# EAGLE schematic HackmodWear (EAGLE 9.1.0)
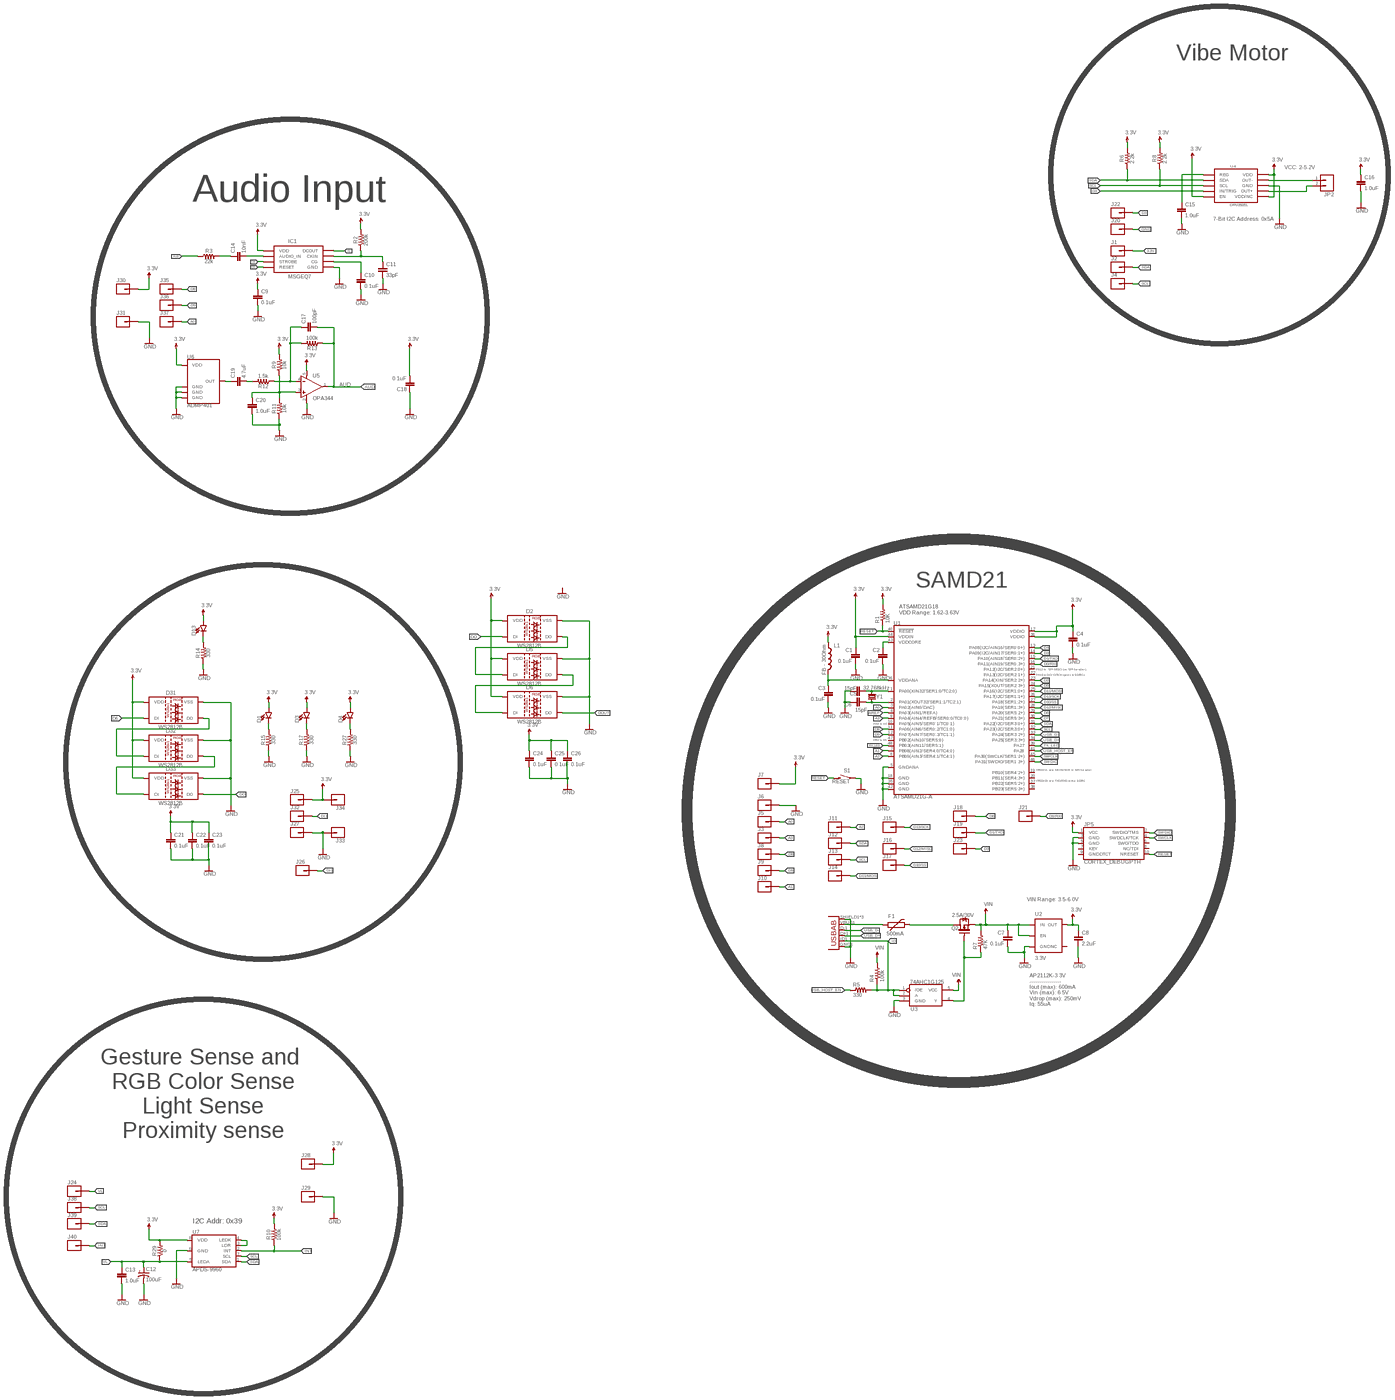
[diagram p0: schematic, sheet 1, overview]
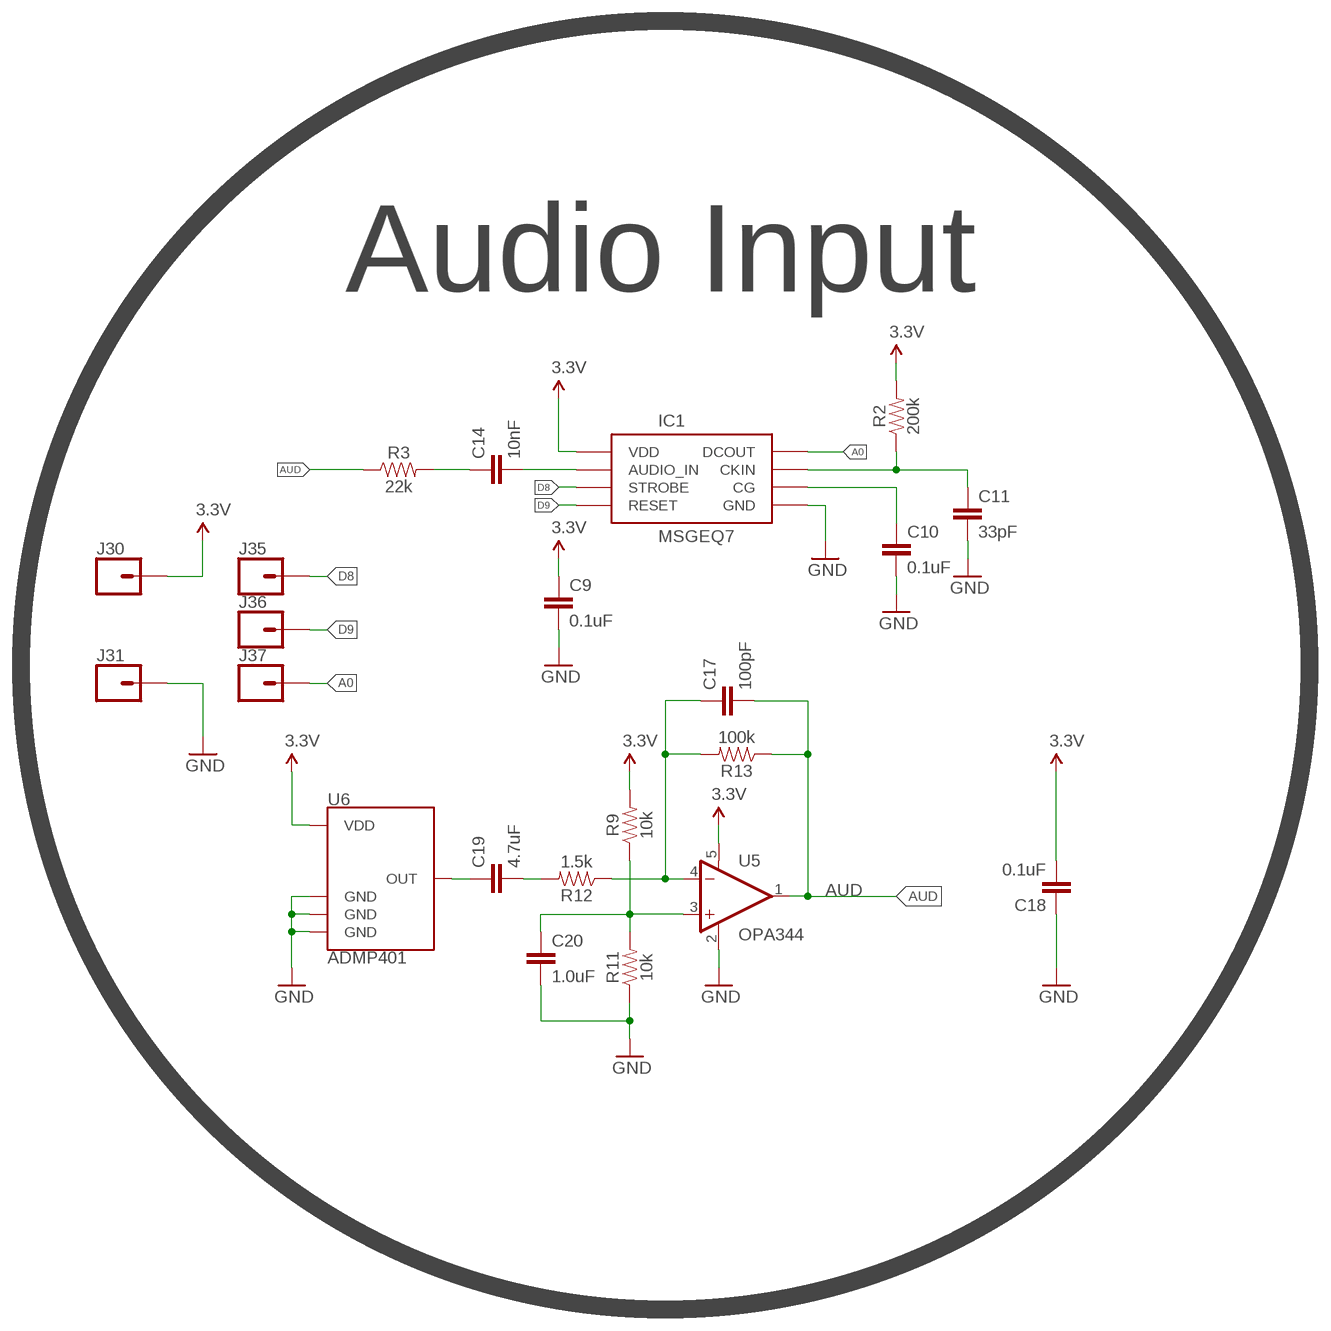
[diagram p1: schematic, sheet 1, part 1 of 4]
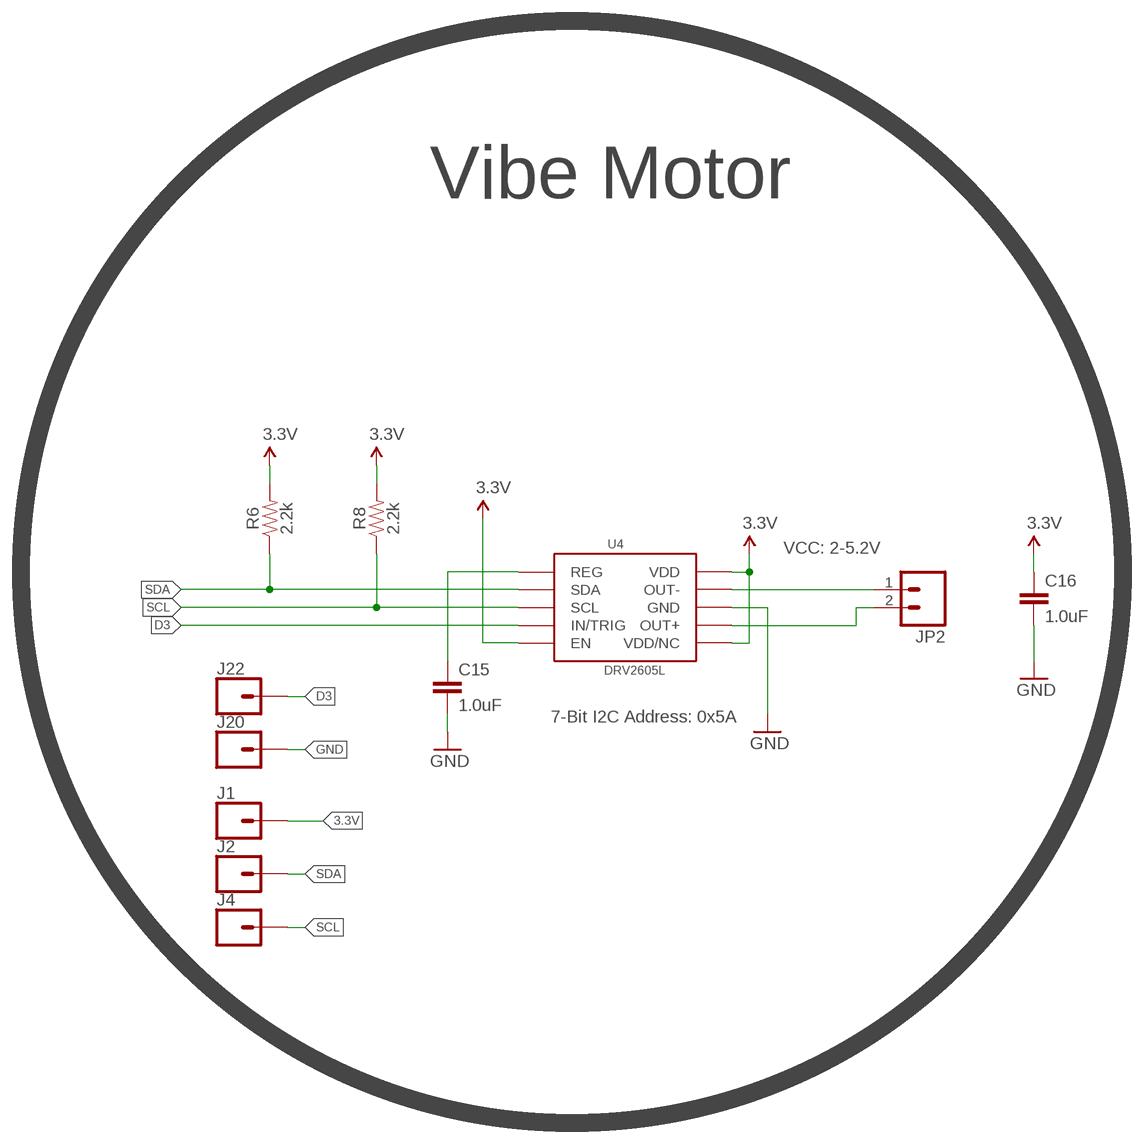
[diagram p2: schematic, sheet 1, part 2 of 4]
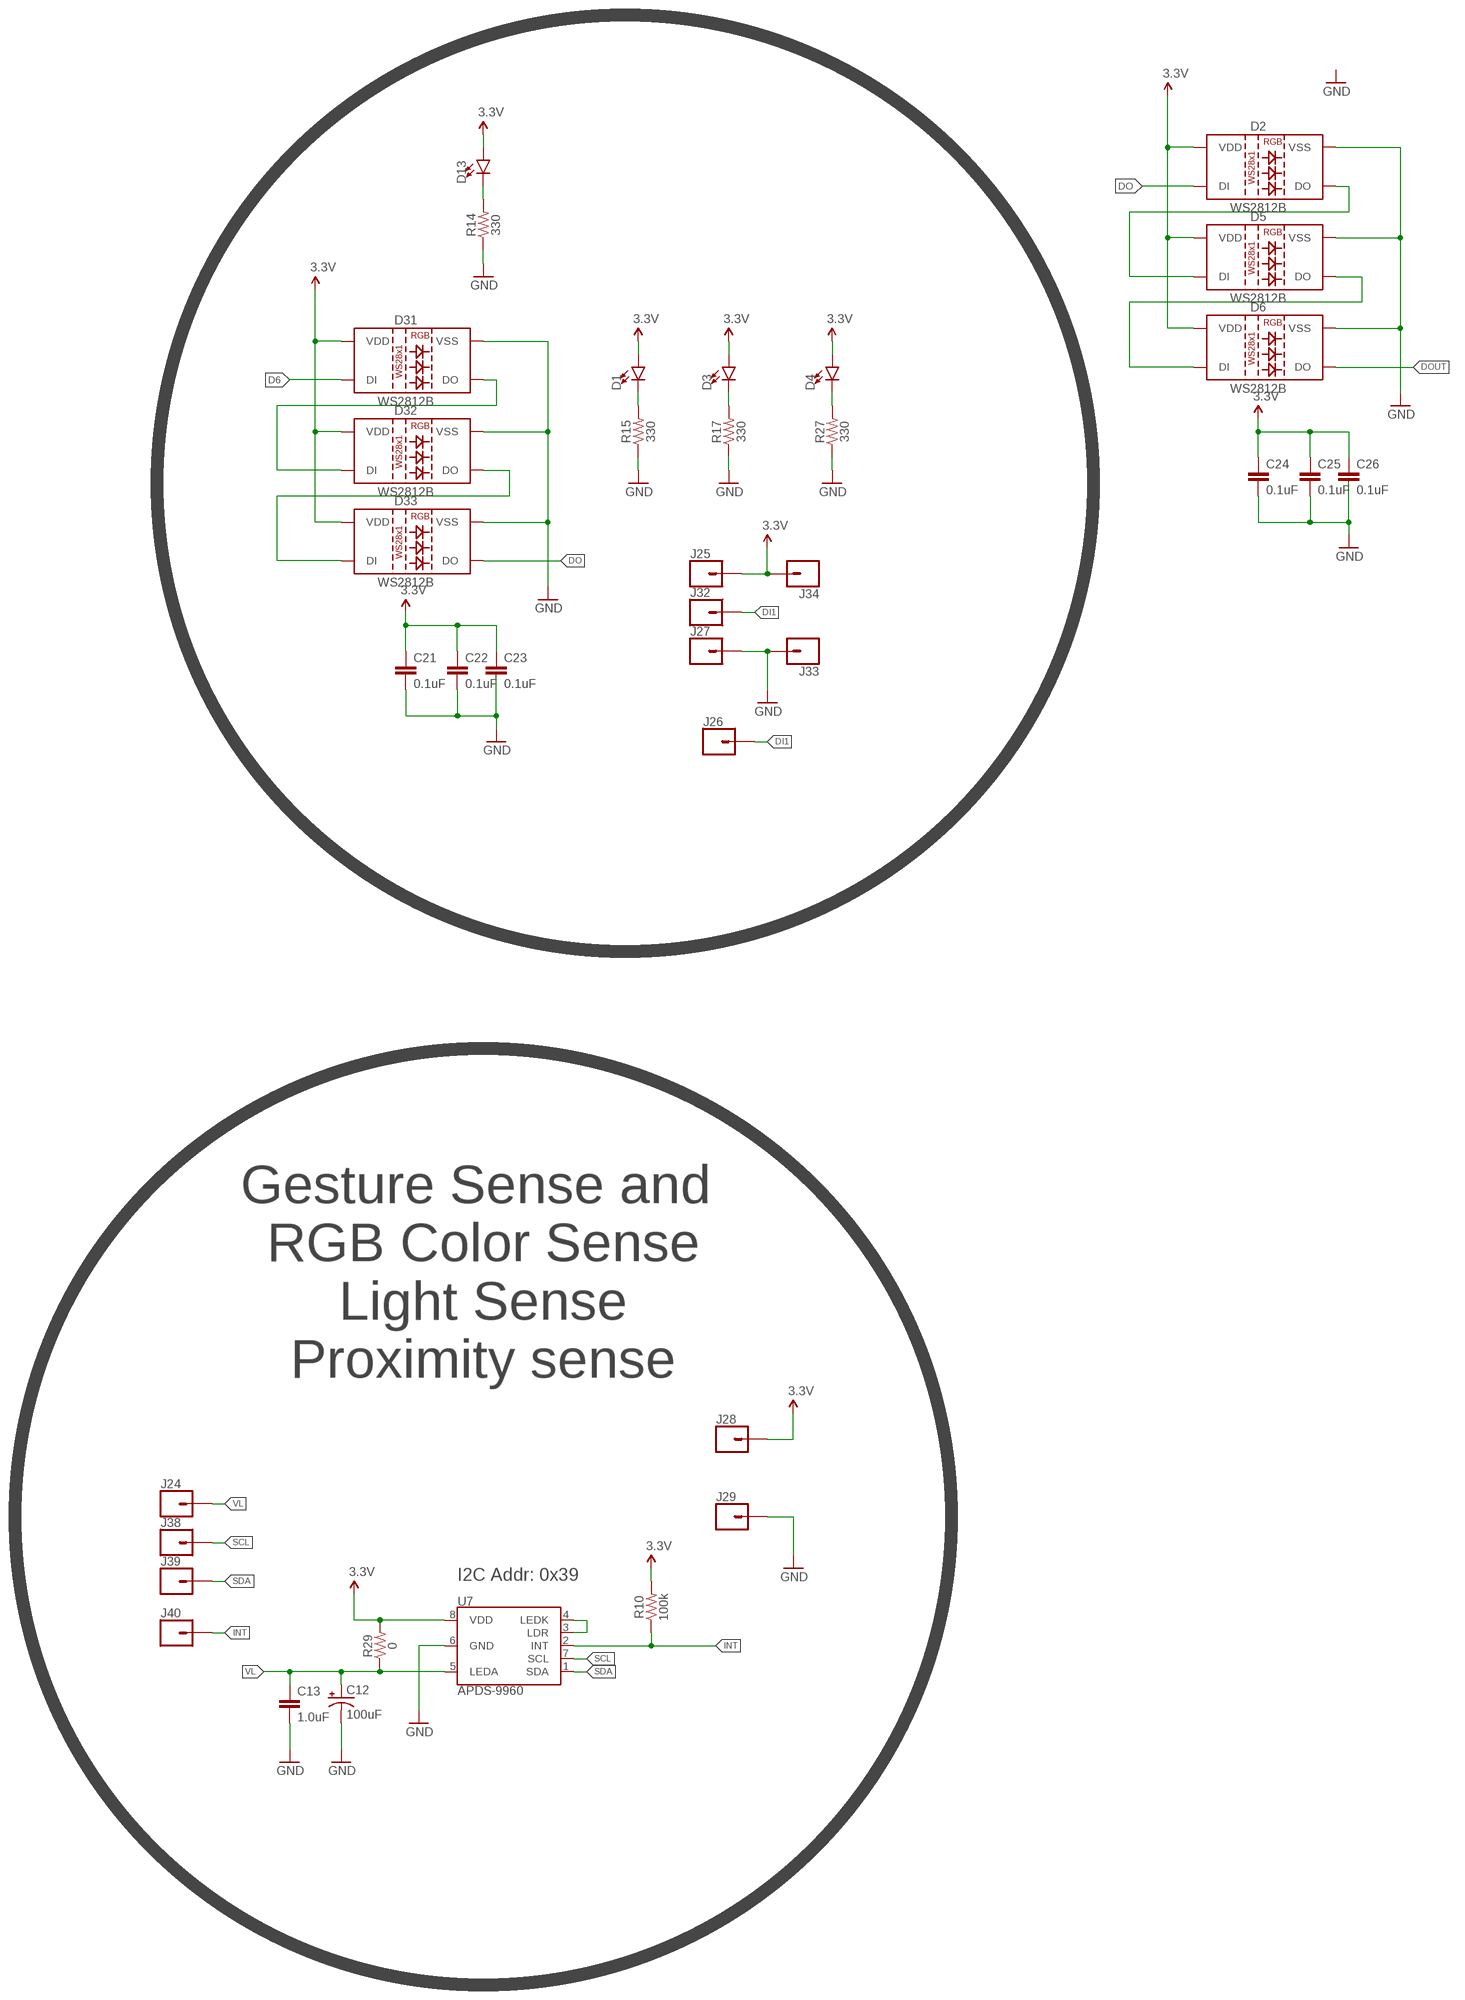
[diagram p3: schematic, sheet 1, part 3 of 4]
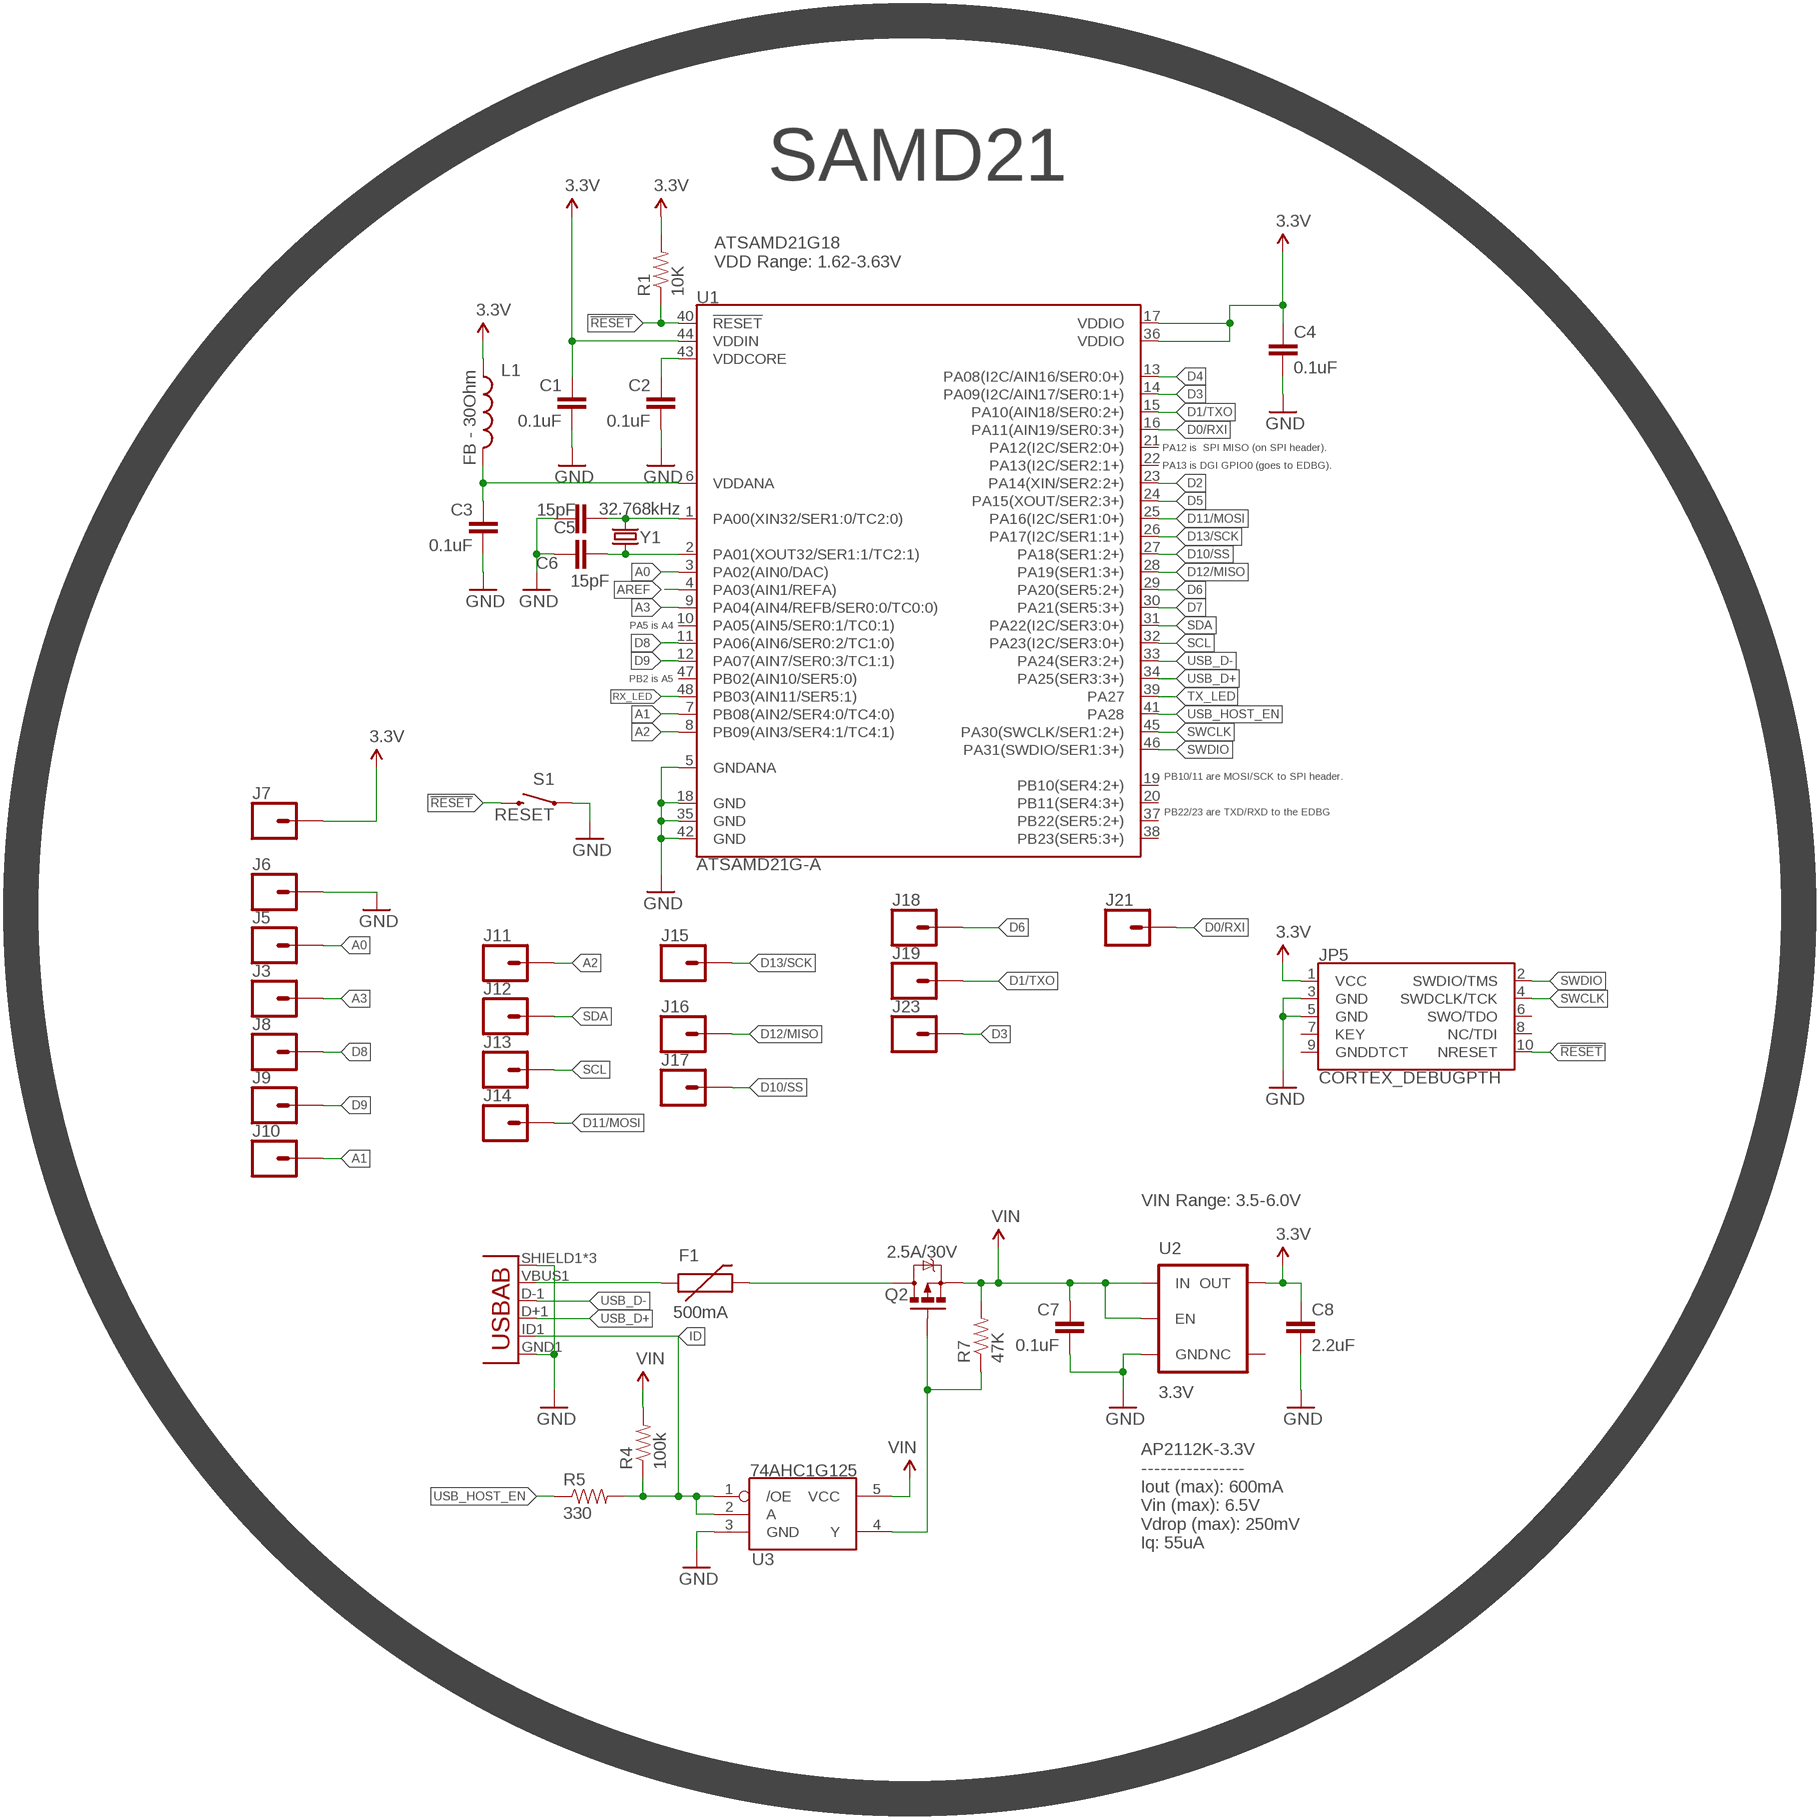
[diagram p4: schematic, sheet 1, part 4 of 4]

## Parts
C1  0.1uF  0.1UF-0603-25V-(+80/-20%)  [0603]
C2  0.1uF  0.1UF-0603-25V-(+80/-20%)  [0603]
C3  0.1uF  0.1UF-0603-25V-(+80/-20%)  [0603]
C4  0.1uF  0.1UF-0603-25V-(+80/-20%)  [0603]
C5  15pF  15PF-0603-50V-5%  [0603]
C6  15pF  15PF-0603-50V-5%  [0603]
C7  0.1uF  0.1UF-0603-25V-(+80/-20%)  [0603]
C8  2.2uF  2.2UF-10V-20%(0603)  [0603-CAP]
C9  0.1uF  0.1UF-0603-25V-(+80/-20%)  [0603]
C10  0.1uF  0.1UF-0603-25V-(+80/-20%)  [0603]
C11  33pF  33PF-0603-50V-5%  [0603]
C12  100uF  100UF-POLAR-EIA7343-10V-10%(TANT)  [EIA7343]
C13  1.0uF  1.0UF-0603-16V-10%  [0603]
C14  10nF  10NF-0603-50V-10%  [0603]
C15  1.0uF  1.0UF-16V-10%(0402)  [0402-CAP]
C16  1.0uF  1.0UF-16V-10%(0402)  [0402-CAP]
C17  100pF  100PF-0603-50V-5%  [0603]
C18  0.1uF  0.1UF-0603-25V-(+80/-20%)  [0603]
C19  4.7uF  4.7UF0603  [0603]
C20  1.0uF  1.0UF-0603-16V-10%  [0603]
C21  0.1uF  0.1UF-0603-25V-(+80/-20%)  [0603]
C22  0.1uF  0.1UF-0603-25V-(+80/-20%)  [0603]
C23  0.1uF  0.1UF-0603-25V-(+80/-20%)  [0603]
C24  0.1uF  0.1UF-0603-25V-(+80/-20%)  [0603]
C25  0.1uF  0.1UF-0603-25V-(+80/-20%)  [0603]
C26  0.1uF  0.1UF-0603-25V-(+80/-20%)  [0603]
D1  LED1206  [LED-1206]
D2  WS2812B  [WS2812B]
D3  LED1206  [LED-1206]
D4  LED1206  [LED-1206]
D5  WS2812B  [WS2812B]
D6  WS2812B  [WS2812B]
D13  LED1206  [LED-1206]
D31  WS2812B  [WS2812B]
D32  WS2812B  [WS2812B]
D33  WS2812B  [WS2812B]
F1  500mA  PTCSMD  [PTC-1206]
IC1  MSGEQ7N  MSGEQ7SOIC  [SO08]
J1  CONN_01  [1X01]
J2  CONN_01  [1X01]
J3  CONN_01  [1X01]
J4  CONN_01  [1X01]
J5  CONN_01  [1X01]
J6  CONN_01  [1X01]
J7  CONN_01  [1X01]
J8  CONN_01  [1X01]
J9  CONN_01  [1X01]
J10  CONN_01  [1X01]
J11  CONN_01  [1X01]
J12  CONN_01  [1X01]
J13  CONN_01  [1X01]
J14  CONN_01  [1X01]
J15  CONN_01  [1X01]
J16  CONN_01  [1X01]
J17  CONN_01  [1X01]
J18  CONN_01  [1X01]
J19  CONN_01  [1X01]
J20  CONN_01  [1X01]
J21  CONN_01  [1X01]
J22  CONN_01  [1X01]
J23  CONN_01  [1X01]
J24  CONN_01  [1X01]
J25  CONN_01  [1X01]
J26  CONN_01  [1X01]
J27  CONN_01  [1X01]
J28  CONN_01  [1X01]
J29  CONN_01  [1X01]
J30  CONN_01  [1X01]
J31  CONN_01  [1X01]
J32  CONN_01  [1X01]
J33  CONN_01  [1X01]
J34  CONN_01  [1X01]
J35  CONN_01  [1X01]
J36  CONN_01  [1X01]
J37  CONN_01  [1X01]
J38  CONN_01  [1X01]
J39  CONN_01  [1X01]
J40  CONN_01  [1X01]
JP2  M02PTH  [1X02@1]
JP3  USB-ABCONN-11794  [USB-AB-MICRO-SMD_V03]
JP5  CORTEX_DEBUGPTH  [2X5-PTH-1.27MM]
L1  FB - 30Ohm  INDUCTOR0603  [0603]
Q2  2.5A/30V  MOSFET-PCHANNELDMG2307L  [SOT23-3]
R1  10K  10KOHM-1/10W-1%(0603)0603  [0603-RES@1]
R2  200k  200KOHM-0603-1/10W-1%  [0603]
R3  22k  22KOHM-0603-1/10W-1%  [0603]
R4  100k  100KOHM-1/10W-1%(0603)  [0603-RES@1]
R5  330  330OHM1/10W1%(0603)  [0603-RES@1]
R6  2.2k  2.2KOHM-0603-1/10W-1%  [0603]
R7  47K  47KOHM1/10W1%(0603)  [0603-RES@1]
R8  2.2k  2.2KOHM-0603-1/10W-1%  [0603]
R9  10k  10KOHM-0603-1/10W-1%  [0603]
R10  100k  100KOHM-0603-1/10W-1%  [0603]
R11  10k  10KOHM-0603-1/10W-1%  [0603]
R12  1.5k  1.5KOHM-0603-1/10W-1%  [0603]
R13  100k  100KOHM-0603-1/10W-1%  [0603]
R14  330  330OHM-0603-1/10W-1%  [0603]
R15  330  330OHM-0603-1/10W-1%  [0603]
R17  330  330OHM-0603-1/10W-1%  [0603]
R27  330  330OHM-0603-1/10W-1%  [0603]
R29  0  0OHM-0603-1/10W-5%  [0603]
S1  RESET  SWITCH-MOMENTARY-2SMD-4.6X2.8MM  [TACTILE_SWITCH_SMD_4.6X2.8MM]
U1  ATSAMD21G-A  [TQFP-48]
U2  3.3V  V_REG_AP2112K-3.3V  [SOT23-5]
U3  74AHC1G125  [SOT23-5]
U4  DRV2605L  [VSSOP-10]
U5  OPA344  [SOT23-5]
U6  ADMP401  [ADMP401]
U7  APDS-9960  [APDS-9960]
Y1  32.768kHz  CRYSTAL3.2X1.5MM  [CRYSTAL-SMD-3.2X1.5MM]

## Nets
3.3V: C1.1 C4.1 C8.1 C9.1 C16.1 C18.2 C21.1 C22.1 C23.1 C24.1 C25.1 C26.1 D1.A D2.1(VDD) D3.A D4.A D5.1(VDD) D6.1(VDD) D13.A D31.1(VDD) D32.1(VDD) D33.1(VDD) IC1.1(VDD) J1.P$1 J7.P$1 J25.P$1 J28.P$1 J30.P$1 J34.P$1 JP5.1(VCC) L1.1 R1.2 R2.2 R6.2 R8.2 R9.2 R10.2 R29.2 U1.17(VDDIO) U1.36(VDDIO) U1.44(VDDIN) U2.5(OUT) U4.P$5(EN) U4.P$6(VDD/NC) U4.P$10(VDD) U5.5(V+) U6.5(VDD) U7.8(VDD)
!RESET: JP5.10(NRESET) R1.1 S1.3 S1.4 U1.40(!RESET!)
A0: IC1.3(DCOUT) J5.P$1 J37.P$1 U1.3(PA02(AIN0/DAC))
A1: J10.P$1 U1.7(PB08(AIN2/SER4:0/TC4:0))
A2: J11.P$1 U1.8(PB09(AIN3/SER4:1/TC4:1))
A3: J3.P$1 U1.9(PA04(AIN4/REFB/SER0:0/TC0:0))
AREF: U1.4(PA03(AIN1/REFA))
AUD: C17.2 R3.1 R13.1 U5.1(OUT)
D0/RXI: J21.P$1 U1.16(PA11(AIN19/SER0:3+))
D1/TXO: J19.P$1 U1.15(PA10(AIN18/SER0:2+))
D2: U1.23(PA14(XIN/SER2:2+))
D3: J22.P$1 J23.P$1 U1.14(PA09(I2C/AIN17/SER0:1+)) U4.P$4(IN/TRIG)
D4: U1.13(PA08(I2C/AIN16/SER0:0+))
D5: U1.24(PA15(XOUT/SER2:3+))
D6: D31.4(DI) J18.P$1 U1.29(PA20(SER5:2+))
D7: U1.30(PA21(SER5:3+))
D8: IC1.4(STROBE) J8.P$1 J35.P$1 U1.11(PA06(AIN6/SER0:2/TC1:0))
D9: IC1.7(RESET) J9.P$1 J36.P$1 U1.12(PA07(AIN7/SER0:3/TC1:1))
D10/SS: J17.P$1 U1.27(PA18(SER1:2+))
D11/MOSI: J14.P$1 U1.25(PA16(I2C/SER1:0+))
D12/MISO: J16.P$1 U1.28(PA19(SER1:3+))
D13/SCK: J15.P$1 U1.26(PA17(I2C/SER1:1+))
DI1: J26.P$1 J32.P$1
DO: D2.4(DI) D33.2(DO)
DOUT: D6.2(DO)
GND: C1.2 C2.2 C3.2 C4.2 C5.1 C6.2 C7.2 C8.2 C9.2 C10.2 C11.2 C12.C(-) C13.2 C15.2 C16.2 C18.1 C20.2 C21.2 C22.2 C23.2 C24.2 C25.2 C26.2 D2.3(VSS) D5.3(VSS) D6.3(VSS) D31.3(VSS) D32.3(VSS) D33.3(VSS) IC1.2(GND) J6.P$1 J20.P$1 J27.P$1 J29.P$1 J31.P$1 J33.P$1 JP3.GND1(GND) JP3.SHIELD1(SHIELD) JP3.SHIELD2(SHIELD) JP3.SHIELD3(SHIELD) JP5.3(GND) JP5.5(GND) R11.1 R14.1 R15.1 R17.1 R27.1 S1.1 S1.2 U1.5(GNDANA) U1.18(GND) U1.35(GND) U1.42(GND) U2.2(GND) U3.3(GND) U4.P$8(GND) U5.2(V-) U6.2(GND) U6.4(GND) U6.6(GND) U7.6(GND)
ID: JP3.ID1(USBID) R4.1 R5.2 U3.1(/OE) U3.2(A)
INT: J40.P$1 R10.1 U7.2(INT)
N$1: F1.1 JP3.VBUS1(VBUS)
N$2: C5.2 U1.1(PA00(XIN32/SER1:0/TC2:0)) Y1.P$2
N$3: C19.1 U6.1(OUT)
N$4: C6.1 U1.2(PA01(XOUT32/SER1:1/TC2:1)) Y1.P$1
N$5: U7.3(LDR) U7.4(LEDK)
N$6: C17.1 R12.1 R13.2 U5.4(-IN)
N$7: F1.2 Q2.3(D)
N$8: D13.C R14.2
N$9: Q2.1(G) R7.1 U3.4(Y)
N$10: C19.2 R12.2
N$11: C20.1 R9.1 R11.2 U5.3(+IN)
N$12: D1.C R15.2
N$13: C15.1 U4.P$1(REG)
N$14: D31.2(DO) D32.4(DI)
N$15: D3.C R17.2
N$16: D32.2(DO) D33.4(DI)
N$17: C14.2 IC1.5(AUDIO_IN)
N$18: C14.1 R3.2
N$19: C10.1 IC1.6(CG)
N$20: C11.1 IC1.8(CKIN) R2.1
N$21: D4.C R27.2
N$22: D2.2(DO) D5.4(DI)
N$23: D5.2(DO) D6.4(DI)
N$24: JP2.1 U4.P$9(OUT-)
N$25: JP2.2 U4.P$7(OUT+)
RX_LED: U1.48(PB03(AIN11/SER5:1))
SCL: J4.P$1 J13.P$1 J38.P$1 R8.1 U1.32(PA23(I2C/SER3:0+)) U4.P$2(SCL) U7.7(SCL)
SDA: J2.P$1 J12.P$1 J39.P$1 R6.1 U1.31(PA22(I2C/SER3:0+)) U4.P$3(SDA) U7.1(SDA)
SWCLK: JP5.4(SWDCLK/TCK) U1.45(PA30(SWCLK/SER1:2+))
SWDIO: JP5.2(SWDIO/TMS) U1.46(PA31(SWDIO/SER1:3+))
TX_LED: U1.39(PA27)
USB_D+: JP3.D+1(D+) U1.34(PA25(SER3:3+))
USB_D-: JP3.D-1(D-) U1.33(PA24(SER3:2+))
USB_HOST_EN: R5.1 U1.41(PA28)
VDDANA: C3.1 L1.2 U1.6(VDDANA)
VDDCORE: C2.1 U1.43(VDDCORE)
VIN: C7.1 Q2.2(S) R4.2 R7.2 U2.1(IN) U2.3(EN) U3.5(VCC)
VL: C12.A(+) C13.1 J24.P$1 R29.1 U7.5(LEDA)
Unconnected: JP5.6(SWO/TDO) JP5.7(KEY) JP5.8(NC/TDI) JP5.9(GNDDTCT) U1.10(PA05(AIN5/SER0:1/TC0:1)) U1.19(PB10(SER4:2+)) U1.20(PB11(SER4:3+)) U1.21(PA12(I2C/SER2:0+)) U1.22(PA13(I2C/SER2:1+)) U1.37(PB22(SER5:2+)) U1.38(PB23(SER5:3+)) U1.47(PB02(AIN10/SER5:0)) U2.4(NC)

## Notes on the sheet
- Vibe Motor
- VCC: 2-5.2V
- Audio Input
- 7-Bit I2C Address: 0x5A
- SAMD21
- ATSAMD21G18
  VDD Range: 1.62-3.63V
- PA12 is  SPI MISO (on SPI header).
- PA13 is DGI GPIO0 (goes to EDBG).
- PA5 is A4
- PB2 is A5
- PB10/11 are MOSI/SCK to SPI header.
- PB22/23 are TXD/RXD to the EDBG
- VIN Range: 3.5-6.0V
- AP2112K-3.3V
  ----------------
  Iout (max): 600mA 
  Vin (max): 6.5V
  Vdrop (max): 250mV
  Iq: 55uA
- Gesture Sense and 
  RGB Color Sense
  Light Sense
  Proximity sense
- I2C Addr: 0x39

## Library data of the parts
C1-C4 C7 C9 C10 C18 C21-C26 = SparkFun-Capacitors:0.1UF: 0.1µF ceramic capacitors A capacitor is a passive two-terminal electrical component used to store electrical energy temporarily in an electric field.; PROD_ID: CAP-00810
C5 C6 = SparkFun-Capacitors:15PF: 15pF ceramic capacitors A capacitor is a passive two-terminal electrical component used to store electrical energy temporarily in an electric field.; PROD_ID: CAP-07881
C8 = SparkFun-Capacitors:2.2UF-10V-20%(0603): CAP-07888; PROD_ID: CAP-07888
C11 = SparkFun-Capacitors:33PF: 33pF ceramic capacitors A capacitor is a passive two-terminal electrical component used to store electrical energy temporarily in an electric field.; PROD_ID: CAP-10142
C12 = SparkFun-Capacitors:100UF-POLAR: 100µF polarized capacitors A capacitor is a passive two-terminal electrical component used to store electrical energy temporarily in an electric field.; PROD_ID: CAP-07890
C13 C20 = SparkFun-Capacitors:1.0UF: 1µF ceramic capacitors A capacitor is a passive two-terminal electrical component used to store electrical energy temporarily in an electric field.; PROD_ID: CAP-00868
C14 = SparkFun-Capacitors:10NF: 0.01uF/10nF/10,000pF ceramic capacitors A capacitor is a passive two-terminal electrical component used to store electrical energy temporarily in an electric field. CAP-09321; PROD_ID: CAP-00867
C15 C16 = SparkFun-Capacitors:1.0UF-16V-10%(0402); PROD_ID: CAP-12417
C17 = SparkFun-Capacitors:100PF: 100pF/0.1nF ceramic capacitors A capacitor is a passive two-terminal electrical component used to store electrical energy temporarily in an electric field.; PROD_ID: CAP-07883
C19 = SparkFun-Capacitors:4.7UF: 4.7µF ceramic capacitors A capacitor is a passive two-terminal electrical component used to store electrical energy temporarily in an electric field.; PROD_ID: CAP-08280
D1 D3 D4 D13 = SparkFun-LED:LED: LED (Generic) Standard schematic elements and footprints for 5mm, 3mm, 1206, and 0603 sized LEDs. Generic LEDs with no color specified.
D2 D5 D6 D31-D33 = SparkFun-LED:WS2812B: WS2812B SMD addressable RGB LED 5x5mm SMD LED with built-in controller IC. Color: Red/Green/Blue mC Rating: RGB: 390, 660, 180 mcd Forward Voltage: RGB: 2.0, 3.0, 3.0 V Packages:WS2812B SparkFun Products: Blynk Board - ESP8266 <https://www.sparkfun.com/products/13794>; PROD_ID: DIO-12503
F1 = SparkFun-PowerIC:PTC: Resettable Fuse PTC Resettable Fuse. Spark Fun Electronics SKU : COM-08357; PROD_ID: RES-11150
IC1 = SparkFun-IC-Special-Function:MSGEQ7: 7-band graphic equalizer This IC is for making a 7 band/channel audio spectrometer. There are two versions of this part. The DIP available on the storefront, and the SO used in product. Datasheet <https://www.sparkfun.com/datasheets/Components/General/MSGEQ7.pdf> SparkFun Products Storefront component: Graphic Equalizer Display Filter - MSGEQ7 <https://www.sparkfun.com/products/10468> (COM-10468) SparkFun Spectrum Shield <https://www.sparkfun.com/products/13116> (DEV-13116); PROD_ID: IC-10141
J1-J40 = SparkFun-Connectors:CONN_01: Single connection point. Often used as Generic Header-pin footprint for 0.1 inch spaced/style header connections On any of the 0.1 inch spaced packages, you can populate with these: Break Away Headers - Straight <https://www.sparkfun.com/products/116> (PRT-00116) Break Away Male Headers - Right Angle <https://www.sparkfun.com/products/553> (PRT-00553) Female Headers <https://www.sparkfun.com/products/115> (PRT-00115) Break Away Headers - Machine Pin <https://www.sparkfun.com/products/117> (PRT-00117) Break Away Female Headers - Swiss Machine Pin <https://www.sparkfun.com/products/743> (PRT-00743) This device is also useful as a general connection point to wire up your design to another part of your project. Our various solder wires solder well into these plated through hole pads. Hook-Up Wire - Assortment (Stranded, 22 AWG) <https://www.sparkfun.com/products/11375> (PRT-11375) Hook-Up Wire - Assortment (Solid Core, 22 AWG) <https://www.sparkfun.com/products/11367> (PRT-11367) View the entire wire category on our website here <https://www.sparkfun.com/categories/141> Special notes: SMTSO-256-ET is a "flush mount" nut for a 4-40 screw. We mostly use this on specialty testbeds; it is a nice way to connect hardware to your PCB at an adjustable hieght. Also note, the SNAP packages are for using a snappable style connector. We sell a baggie of snaps and they are also used on two LilyPad designs: Snap Assortment - 30 pack (male and female) <https://www.sparkfun.com/products/11347> (DEV-11347) LilyPad Arduino SimpleSnap <https://www.sparkfun.com/products/10941> (DEV-10941) LilyPad SimpleSnap Protoboard <https://www.sparkfun.com/products/10940> (DEV-10940)
JP2 = SparkFun-Connectors:M02: Standard 2-pin 0.1" header. Use with - straight break away headers ( PRT-00116) - right angle break away headers (PRT-00553) - swiss pins (PRT-00743) - machine pins (PRT-00117) - female headers (PRT-00115) Molex polarized connector foot print use with: PRT-08233 with associated crimp pins and housings. 2.54_SCREWTERM for use with PRT-10571. 3.5mm Screw Terminal footprints for PRT-08084 5mm Screw Terminal footprints for use with PRT-08432
JP3 = SparkFun-Connectors:USB-AB: This is a USB AB connector that is compatible with USB OTG. i.e. this connector can serve as a host or device; PROD_ID: CONN-11794
JP5 = samd21-temp:CORTEX_DEBUG: Cortex Debug Connector Datasheet <http://infocenter.arm.com/help/topic/com.arm.doc.faqs/attached/13634/cortex_debug_connectors.pdf>
L1 = SparkFun-Passives:INDUCTOR: Inductors Basic Inductor/Choke - 0603 and 1206. Footprints are not proven and vary greatly between part numbers. INDUCTOR POWER 3.3UH 4.0A SMD 0.197" L x 0.197" W x 0.177" H (5.00mm x 5.00mm x 4.50mm); PROD_ID: RES-07859
Q2 = SparkFun-DiscreteSemi:MOSFET-PCHANNEL: Generic PMOSFET IRLML2244 - TRANS-11153 (SOT-23 -20V -4.3A) (1.Gate 2.Source 3.Drain) FQP27P06 - COM-10349 <http://www.sparkfun.com/products/10349> (TO-220 -60V -27A) (1.Gate 2.Source 3.Drain); PROD_ID: TRANS-11308
R1 = SparkFun-Resistors:10KOHM-1/10W-1%(0603): RES-00824; PROD_ID: RES-00824
R2 = SparkFun-Resistors:200KOHM: 200kΩ resistor A resistor is a passive two-terminal electrical component that implements electrical resistance as a circuit element. Resistors act to reduce current flow, and, at the same time, act to lower voltage levels within circuits. - Wikipedia; PROD_ID: RES-09385
R3 = SparkFun-Resistors:22KOHM: 22kΩ resistor A resistor is a passive two-terminal electrical component that implements electrical resistance as a circuit element. Resistors act to reduce current flow, and, at the same time, act to lower voltage levels within circuits. - Wikipedia; PROD_ID: RES-07853
R4 = SparkFun-Resistors:100KOHM-1/10W-1%(0603): RES-07828; PROD_ID: RES-07828
R5 = SparkFun-Resistors:330OHM1/10W1%(0603): RES-00818; PROD_ID: RES-00818
R6 R8 = SparkFun-Resistors:2.2KOHM: 2.2kΩ resistor A resistor is a passive two-terminal electrical component that implements electrical resistance as a circuit element. Resistors act to reduce current flow, and, at the same time, act to lower voltage levels within circuits. - Wikipedia; PROD_ID: RES-08272
R7 = SparkFun-Resistors:47KOHM1/10W1%(0603): RES-07871; PROD_ID: RES-07871
R9 R11 = SparkFun-Resistors:10KOHM: 10kΩ resistor A resistor is a passive two-terminal electrical component that implements electrical resistance as a circuit element. Resistors act to reduce current flow, and, at the same time, act to lower voltage levels within circuits. - Wikipedia; PROD_ID: RES-00824
R10 R13 = SparkFun-Resistors:100KOHM: 100kΩ resistor A resistor is a passive two-terminal electrical component that implements electrical resistance as a circuit element. Resistors act to reduce current flow, and, at the same time, act to lower voltage levels within circuits. - Wikipedia; PROD_ID: RES-07828
R12 = SparkFun-Resistors:1.5KOHM: 1.5kΩ resistor A resistor is a passive two-terminal electrical component that implements electrical resistance as a circuit element. Resistors act to reduce current flow, and, at the same time, act to lower voltage levels within circuits. - Wikipedia; PROD_ID: RES-08306
R14 R15 R17 R27 = SparkFun-Resistors:330OHM: 330Ω resistor A resistor is a passive two-terminal electrical component that implements electrical resistance as a circuit element. Resistors act to reduce current flow, and, at the same time, act to lower voltage levels within circuits. - Wikipedia; PROD_ID: RES-00818
R29 = SparkFun-Resistors:0OHM: 0Ω resistor A resistor is a passive two-terminal electrical component that implements electrical resistance as a circuit element. Resistors act to reduce current flow, and, at the same time, act to lower voltage levels within circuits. - Wikipedia; PROD_ID: RES-08609
S1 = samd21-temp:SWITCH-MOMENTARY-2: Various NO switches- pushbuttons, reed, etc; PROD_ID: SWCH-13065
U1 = samd21-temp:ATSAMD21G: Atmel SAMD21G SMART ARM-Based Microcontroller The Atmel ® | SMART ™ SAM D21 is a series of low-power microcontrollers using the 32-bit ARM ® Cortex ® -M0+ processor, and ranging from 32- to 64-pins with up to 256KB Flash and 32KB of SRAM. The SAM D21 devices operate at a maximum frequency of 48MHz and reach 2.46 CoreMark/MHz. They are designed for simple and intuitive migration with identical peripheral modules, hex compatible code, identical linear address map and pin compatible migration paths between all devices in the product series. All devices include intelligent and flexible peripherals, Atmel Event System for inter-peripheral signaling, and support for capacitive touch button, slider and wheel user interfaces.; PROD_ID: IC-13064
U2 = SparkFun-PowerIC:V_REG_AP2112: AP2112 - 600mA CMOS LDO Regulator w/ Enable The AP2112 is CMOS process low dropout linear regulator with enable function, the regulator delivers a guaranteed 600mA (min.) continuous load current. Features Output Voltage Accuracy: ±1.5% Output Current: 600mA (Min.) Foldback Short Current Protection: 50mA Enable Function to Turn ON/OFF VOUT Low Dropout Voltage (3.3V): 250mV (Typ.) @IOUT=600mA Excellent Load Regulation: 0.2%/A (Typ.) Excellent Line Regulation: 0.02%/V (Typ.) Low Quiescent Current: 55μA (Typ.) Low Standby Current: 0.01μA (Typ.) Low Output Noise: 50μVRMS PSRR: 100Hz -65dB, 1kHz -65dB OTSD Protection Stable with 1.0μF Flexible Cap: Ceramic, Tantalum and Aluminum Electrolytic Operation Temperature Range: -40°C to 85°C ESD: MM 400V, HBM 4000V; PROD_ID: VREG-12457
U3 = SparkFun-DigitalIC:74AHC1G125: Single bus buffer gate with 3-state output; PROD_ID: IC-11920
U4 = SparkFun-PowerIC:DRV2605L; PROD_ID: IC-13504
U5 = SparkFun:OPA344
U6 = SparkFun-Sensors:ADMP401: ADMP401 - Omnidirection Bottom-Port MEMS Microphone The ADMP401 is a high quality, low cost, low power analog output bottom-ported omnidirectional MEMS microphone. The ADMP401 consists of a MEMS microphone element, an impedance converter, and an output amplifier. The ADMP401 sensitivity specification makes it an excellent choice for both near field and far field applications. Datasheet <http://www.analog.com/media/en/technical-documentation/obsolete-data-sheets/ADMP401.pdf> SparkFun Products SparkFun MEMS Microphone Breakout - INMP401 (ADMP401) <https://www.sparkfun.com/products/9868> (BOB-09868) MEMS Microphone - INMP401 (ADMP401) <https://www.sparkfun.com/products/10028> (COM-10028); PROD_ID: IC-09773
U7 = SparkFun-Sensors:APDS-9960: Avago APDS-9960 Digital Proximity, Ambient Light, RGB, and Gesture Sensor. The APDS-9960 offers ambient light and color measuring, proximity detection, and touchless gesture sensing. It features UV and IR blocking filters, four separate diodes sensitive to different directions, and an I2C compatible interface. Datasheet <https://cdn.sparkfun.com/datasheets/Sensors/Proximity/apds9960.pdf> SparkFun Products SparkFun RGB and Gesture Sensor - APDS-9960 <https://www.sparkfun.com/products/12787> (SEN-12787); PROD_ID: SEN-12005
Y1 = samd21-temp:CRYSTAL: Various standard crystals. Proven footprints.; PROD_ID: XTAL-13062